# Altium project RF_board.PrjPCB
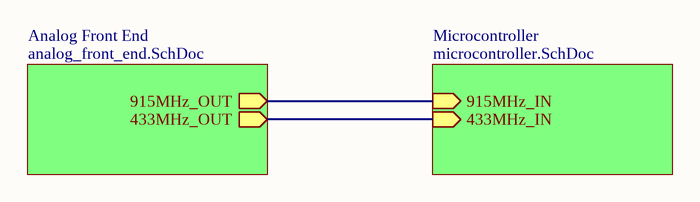
[diagram p0: RF_top.SchDoc]
3 sheets, 87 parts. Net scope: hierarchical (ports join the sheet entries above them; power ports are global).
Board file: RF_board.PcbDoc
Sheets:
  RF_top.SchDoc
    Analog Front End = analog_front_end.SchDoc
    Microcontroller = microcontroller.SchDoc

## Sheet RF_top.SchDoc
size A

### Sub-sheets
Analog Front End = analog_front_end.SchDoc: 915MHz_OUT (out), 433MHz_OUT (out)
Microcontroller = microcontroller.SchDoc: 915MHz_IN (in), 433MHz_IN (in)

### Nets
NetC16_2: sheet Analog Front End/915MHz_OUT, sheet Microcontroller/915MHz_IN
NetC26_2: sheet Analog Front End/433MHz_OUT, sheet Microcontroller/433MHz_IN

## Sheet analog_front_end.SchDoc
size B
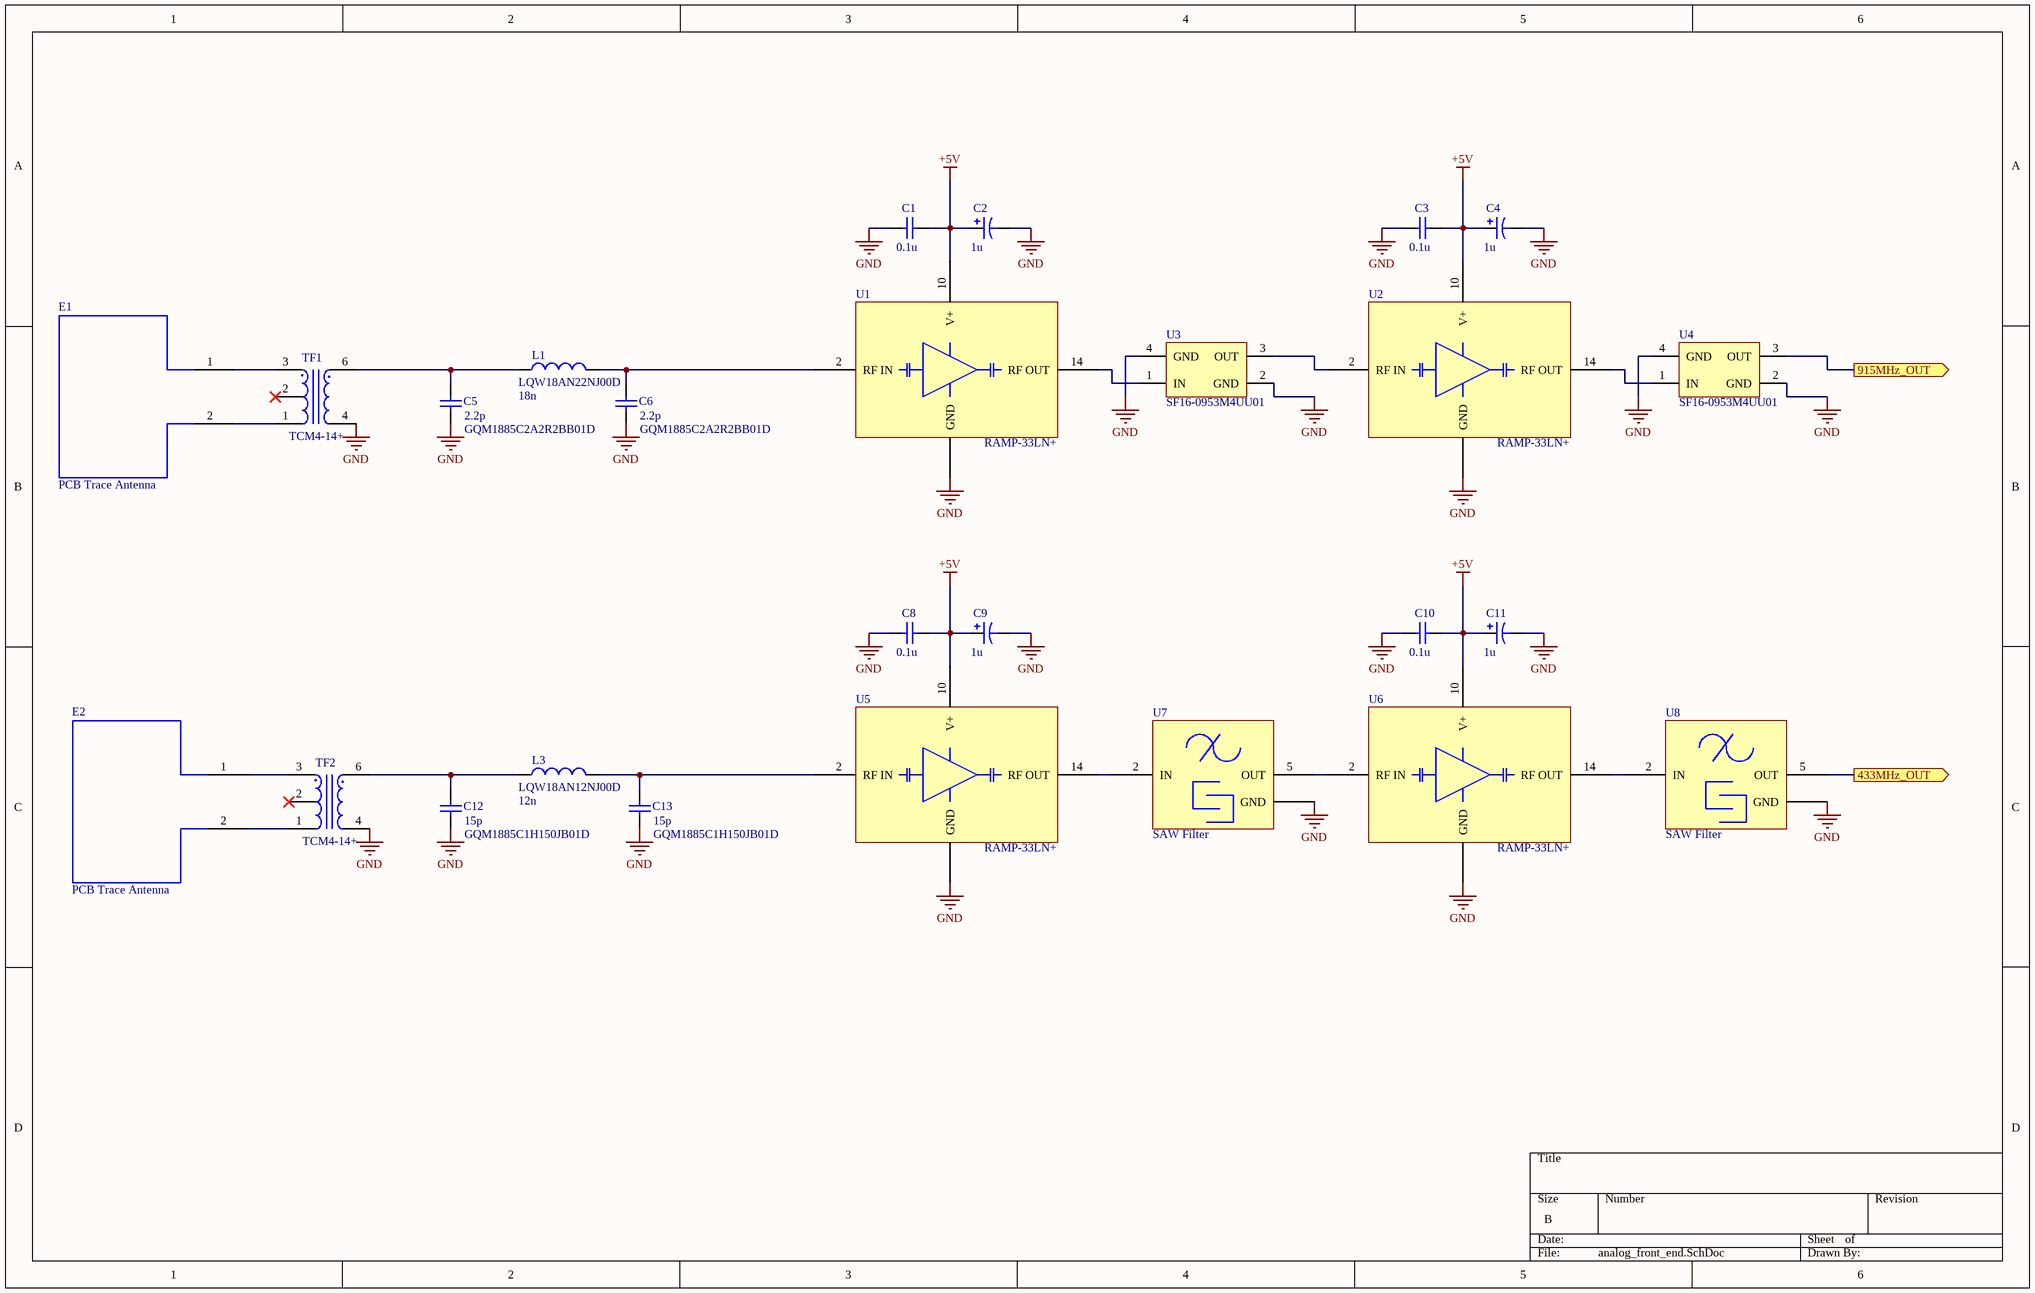
[diagram p1: analog_front_end.SchDoc]

### Parts
C1  value 0.1u  [CAPC1608M]  (hidden comment: Cap Semi)
C2  value 1u  [B]  (hidden comment: Cap Pol3)
C3  value 0.1u  [CAPC1608M]  (hidden comment: Cap Semi)
C4  value 1u  [B]  (hidden comment: Cap Pol3)
C5  GQM1885C2A2R2BB01D  value 2.2p  [CAPC1608M]
C6  GQM1885C2A2R2BB01D  value 2.2p  [CAPC1608M]
C8  value 0.1u  [CAPC1608M]  (hidden comment: Cap Semi)
C9  value 1u  [B]  (hidden comment: Cap Pol3)
C10  value 0.1u  [CAPC1608M]  (hidden comment: Cap Semi)
C11  value 1u  [B]  (hidden comment: Cap Pol3)
C12  GQM1885C1H150JB01D  value 15p  [CAPC1608M]
C13  GQM1885C1H150JB01D  value 15p  [CAPC1608M]
E1  PCB Trace Antenna  [PCB Trace Antenna]
E2  PCB Trace Antenna  [PCB Trace Antenna]
L1  LQW18AN22NJ00D  value 18n  [INDC1608M]
L3  LQW18AN12NJ00D  value 12n  [INDC1608M]
TF1  TCM4-14+  [TCM4-14+]
TF2  TCM4-14+  [TCM4-14+]
U1  RAMP-33LN+  [RAMP-33LN+]
U2  RAMP-33LN+  [RAMP-33LN+]
U3  SF16-0953M4UU01  [SF16-0953M4UU01]
U4  SF16-0953M4UU01  [SF16-0953M4UU01]
U5  RAMP-33LN+  [RAMP-33LN+]
U6  RAMP-33LN+  [RAMP-33LN+]
U7  SAW Filter  [Epcos SAW Filter]
U8  SAW Filter  [Epcos SAW Filter]

### Ports
433MHz_OUT (out), 915MHz_OUT (out)

### Nets
+5V: C1.1 C2.1 C3.1 C4.1 C8.1 C9.1 C10.1 C11.1 U1.10(V+) U2.10(V+) U5.10(V+) U6.10(V+)
GND: C1.2 C2.2 C3.2 C4.2 C5.1 C6.1 C8.2 C9.2 C10.2 C11.2 C12.1 C13.1 TF1.4 TF2.4 U1.1(GND) U1.3(GND) U1.4(GND) U1.5(GND) U1.6(GND) U1.7(GND) U1.8(GND) U1.9(GND) U1.11(GND) U1.12(GND) U1.13(GND) U1.15(GND) U1.16(GND) U2.1(GND) U2.3(GND) U2.4(GND) U2.5(GND) U2.6(GND) U2.7(GND) U2.8(GND) U2.9(GND) U2.11(GND) U2.12(GND) U2.13(GND) U2.15(GND) U2.16(GND) U3.2(GND) U3.4(GND) U4.2(GND) U4.4(GND) U5.1(GND) U5.3(GND) U5.4(GND) U5.5(GND) U5.6(GND) U5.7(GND) U5.8(GND) U5.9(GND) U5.11(GND) U5.12(GND) U5.13(GND) U5.15(GND) U5.16(GND) U6.1(GND) U6.3(GND) U6.4(GND) U6.5(GND) U6.6(GND) U6.7(GND) U6.8(GND) U6.9(GND) U6.11(GND) U6.12(GND) U6.13(GND) U6.15(GND) U6.16(GND) U7.1(GND) U7.3(GND) U7.4(GND) U7.6(GND) U8.1(GND) U8.3(GND) U8.4(GND) U8.6(GND)
NetC5_2: C5.2 L1.1 TF1.6
NetC6_2: C6.2 L1.2 U1.2(RF_IN)
NetC12_2: C12.2 L3.1 TF2.6
NetC13_2: C13.2 L3.2 U5.2(RF_IN)
NetC16_2: U4.3(OUT) ; port 915MHz_OUT
NetC26_2: U8.5(OUT) ; port 433MHz_OUT
NetE1_1: E1.1 TF1.3
NetE1_2: E1.2 TF1.1
NetE2_1: E2.1 TF2.3
NetE2_2: E2.2 TF2.1
NetU1_14: U1.14(RF_OUT) U3.1(IN)
NetU2_2: U2.2(RF_IN) U3.3(OUT)
NetU2_14: U2.14(RF_OUT) U4.1(IN)
NetU5_14: U5.14(RF_OUT) U7.2(IN)
NetU6_2: U6.2(RF_IN) U7.5(OUT)
NetU6_14: U6.14(RF_OUT) U8.2(IN)

Not connected (* = marked no-connect by the designer): TF1 2*; TF2 2*

### Library data of the parts
C1 C3 C5 C6 C8 C10 C12 C13 = Cap Semi: Capacitor (Semiconductor SIM Model); Published: 8-Jun-2000; LatestRevisionDate: 29-May-2009; LatestRevisionNote: IPC-7351 Footprint Added.; PackageReference: C1206; Publisher: Altium Limited; PackageDescription: Chip Capacitor
C2 C4 C9 C11 = Cap Pol3: Polarized Capacitor (Surface Mount); Published: 8-Jun-2000; LatestRevisionDate: 29-May-2009; LatestRevisionNote: IPC-7351 Footprint Added.; PackageReference: C0805; Publisher: Altium Limited; PackageDescription: Chip Capacitor
L1 L3 = Inductor: Code_IEC: 1005; Published: 8-Jun-2000; LatestRevisionDate: 29-May-2009; LatestRevisionNote: IPC-7351 Footprint Added.; PackageReference: 0402-A; Publisher: Altium Limited; PackageDescription: Chip Inductor; Code_JEITA: 0402
TF1 TF2 = TCM4-14+: Mini-Circuits Surface Mount RF Transformer; Manufacturer's Part No.: TCM4-14+; Mini-Circuits: TCM4-14+
U1 U2 U5 U6 = RAMP-33LN+: Mini-Circuits - RAMP-33LN+; Manufacturer's Part No.: RAMP-33LN+
U3 U4 = SF16-0953M4UU01: AVX Corp/Kyocera Corp - FILTER SAW 953MHZ RF SMD; Digikey Number: 478-6489-1-ND

## Sheet microcontroller.SchDoc
size B
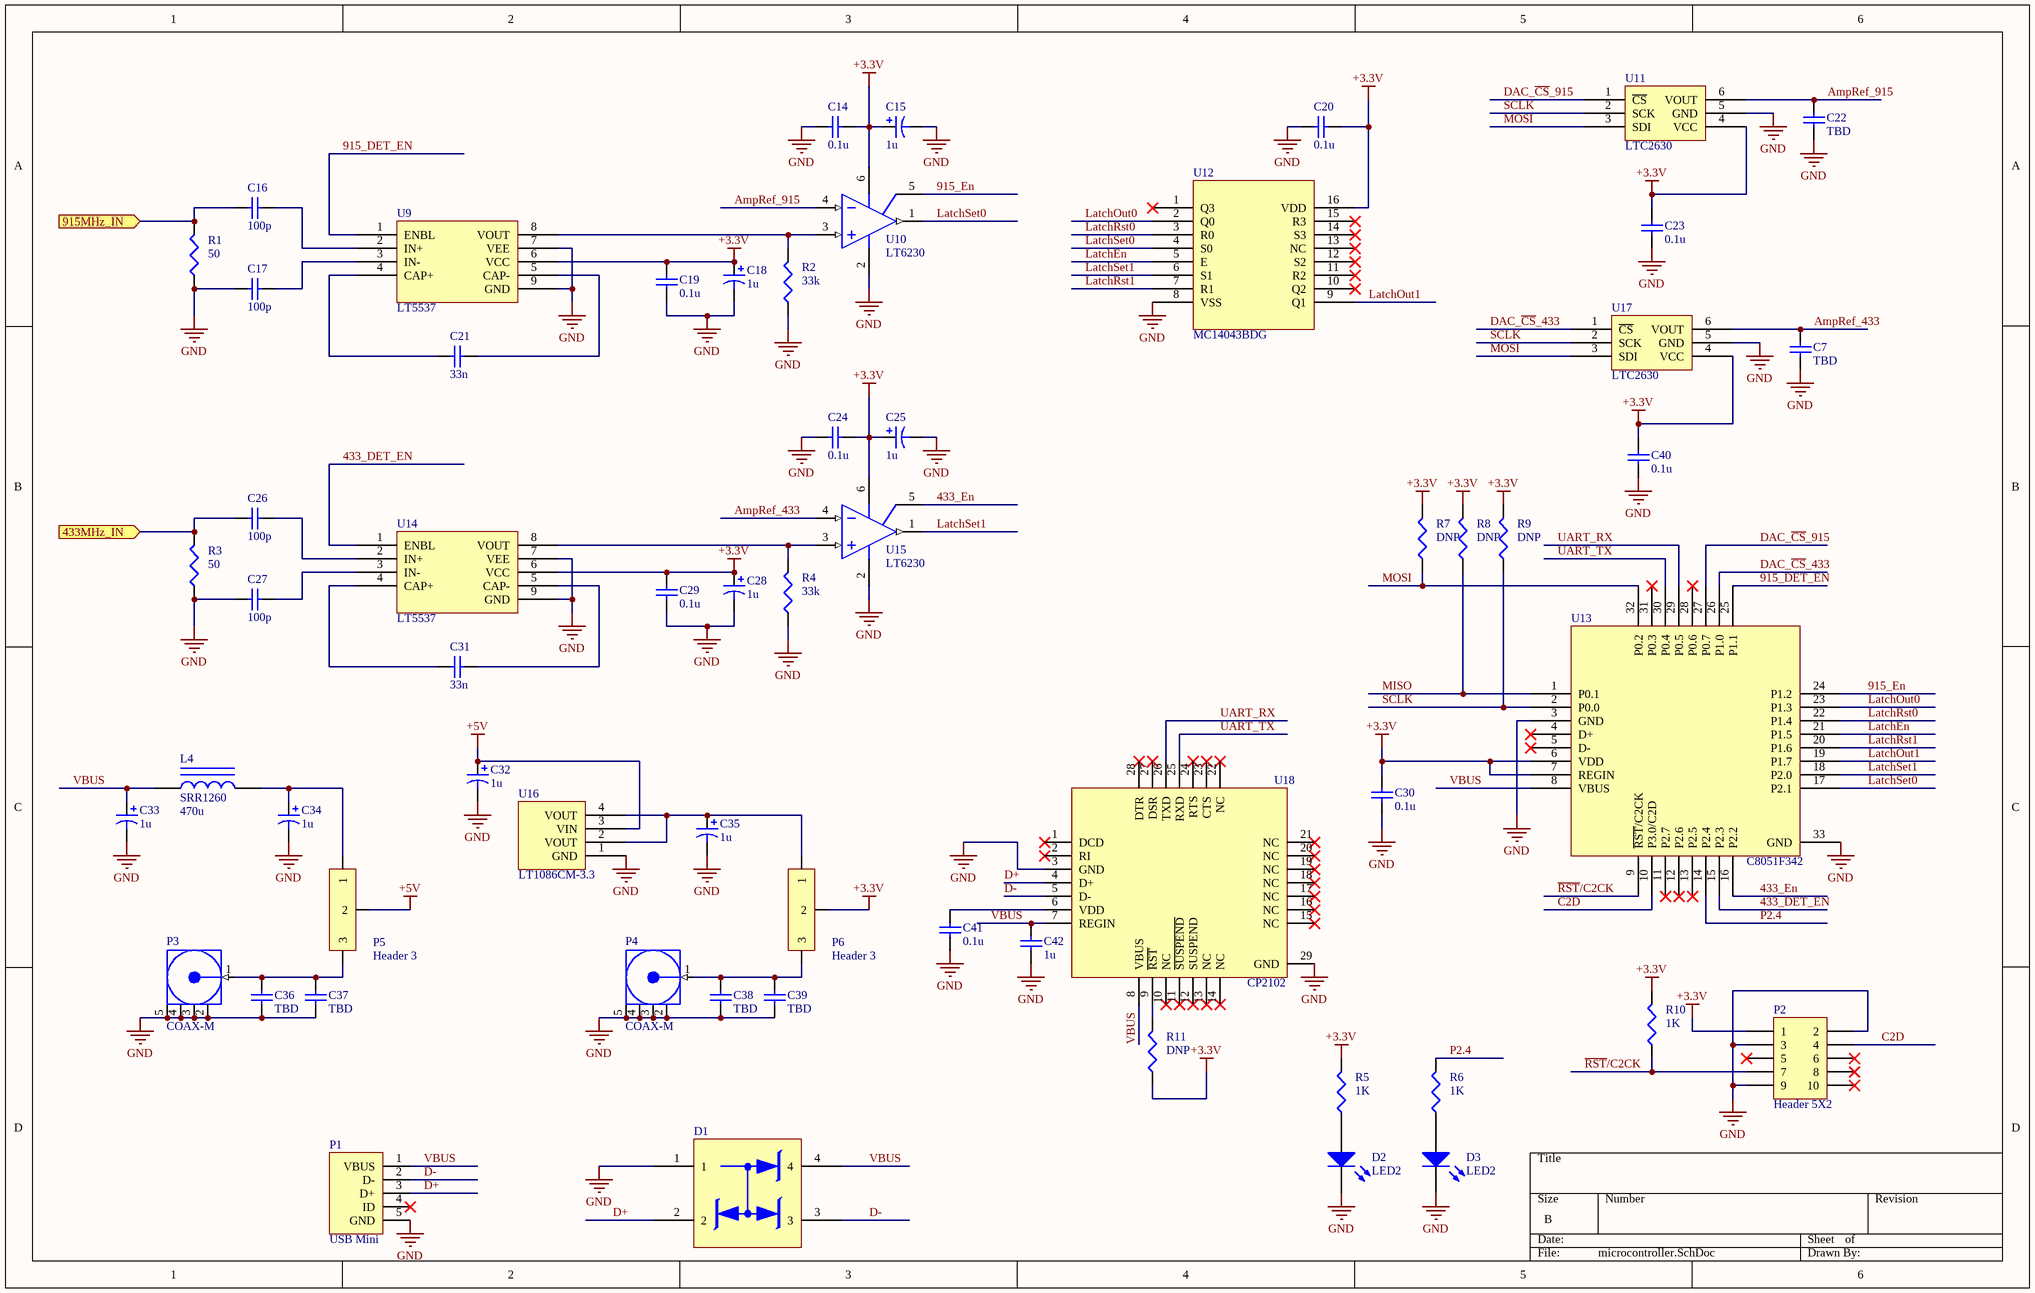
[diagram p2: microcontroller.SchDoc]

### Parts
C7  value TBD  [CAPC1608M]  (hidden comment: Cap Semi)
C14  value 0.1u  [CAPC1608M]  (hidden comment: Cap Semi)
C15  value 1u  [B]  (hidden comment: Cap Pol3)
C16  value 100p  [CAPC1005L]  (hidden comment: Cap Semi)
C17  value 100p  [CAPC1005L]  (hidden comment: Cap Semi)
C18  value 1u  [B]  (hidden comment: Cap Pol3)
C19  value 0.1u  [CAPC1608M]  (hidden comment: Cap Semi)
C20  value 0.1u  [CAPC1608M]  (hidden comment: Cap Semi)
C21  value 33n  [CAPC1005L]  (hidden comment: Cap Semi)
C22  value TBD  [CAPC1608M]  (hidden comment: Cap Semi)
C23  value 0.1u  [CAPC1608M]  (hidden comment: Cap Semi)
C24  value 0.1u  [CAPC1608M]  (hidden comment: Cap Semi)
C25  value 1u  [B]  (hidden comment: Cap Pol3)
C26  value 100p  [CAPC1005L]  (hidden comment: Cap Semi)
C27  value 100p  [CAPC1005L]  (hidden comment: Cap Semi)
C28  value 1u  [B]  (hidden comment: Cap Pol3)
C29  value 0.1u  [CAPC1608M]  (hidden comment: Cap Semi)
C30  value 0.1u  [CAPC1608M]  (hidden comment: Cap Semi)
C31  value 33n  [CAPC1005L]  (hidden comment: Cap Semi)
C32  value 1u  [B]  (hidden comment: Cap Pol3)
C33  value 1u  [B]  (hidden comment: Cap Pol3)
C34  value 1u  [B]  (hidden comment: Cap Pol3)
C35  value 1u  [B]  (hidden comment: Cap Pol3)
C36  value TBD  [CAPC1608M]  (hidden comment: Cap Semi)
C37  value TBD  [CAPC1608M]  (hidden comment: Cap Semi)
C38  value TBD  [CAPC1608M]  (hidden comment: Cap Semi)
C39  value TBD  [CAPC1608M]  (hidden comment: Cap Semi)
C40  value 0.1u  [CAPC1608M]  (hidden comment: Cap Semi)
C41  value 0.1u  [CAPC1608M]  (hidden comment: Cap Semi)
C42  value 1u  [CAPC1608M]  (hidden comment: Cap Semi)
D1  SP0503BAHT  [SOT190P230X110-4M]  (value not drawn)
D2  LED2  [3.2X1.6X1.1]
D3  LED2  [3.2X1.6X1.1]
L4  SRR1260  value 470u  [SRR1260]
P1  USB Mini  [Hirose - ZX62-B-5PA(11)]
P2  Header 5X2  [HDR2X5]
P3  COAX-M  [SMA Connector]
P4  COAX-M  [SMA Connector]
P5  Header 3  [HDR1X3]
P6  Header 3  [HDR1X3]
R1  value 50  [RESC1005L]  (hidden comment: Res3)
R2  value 33k  [RESC1608M]  (hidden comment: Res3)
R3  value 50  [RESC1005L]  (hidden comment: Res3)
R4  value 33k  [RESC1608M]  (hidden comment: Res3)
R5  value 1K  [RESC1608M]  (hidden comment: Res3)
R6  value 1K  [RESC1608M]  (hidden comment: Res3)
R7  value DNP  [RESC1608M]  (hidden comment: Res3)
R8  value DNP  [RESC1608M]  (hidden comment: Res3)
R9  value DNP  [RESC1608M]  (hidden comment: Res3)
R10  value 1K  [RESC1608M]  (hidden comment: Res3)
R11  value DNP  [RESC1608M]  (hidden comment: Res3)
U9  LT5537  [DDB Package]
U10  LT6230  [SOT100P275-6M]
U11  LTC2630  [SOT100P275-6M]
U12  MC14043BDG  [SOIC127P602-16BM]
U13  C8051F342  [QFN50P500X500-32VBM]
U14  LT5537  [DDB Package]
U15  LT6230  [SOT100P275-6M]
U16  LT1086CM-3.3  [TO254P1420-4AM]
U17  LTC2630  [SOT100P275-6M]
U18  CP2102  [QFN50P500X500-28V1L]

### Ports
433MHz_IN (in), 915MHz_IN (in)

### Nets
+3.3V: C14.2 C15.1 C18.1 C19.1 C20.2 C23.2 C24.2 C25.1 C28.1 C29.1 C30.2 C40.2 P2.1 P6.2 R5.2 R7.2 R8.2 R9.2 R10.2 R11.1 U9.6(VCC) U10.6(V+) U11.4(VCC) U12.16(VDD) U13.6(VDD) U13.7(REGIN) U14.6(VCC) U15.6(V+) U17.4(VCC)
+5V: C32.1 P5.2 U16.3(VIN)
GND: C7.1 C14.1 C15.2 C17.2 C18.2 C19.2 C20.1 C22.1 C23.1 C24.1 C25.2 C27.2 C28.2 C29.2 C30.1 C32.2 C33.2 C34.2 C35.2 C36.2 C37.2 C38.2 C39.2 C40.1 C41.1 C42.1 D1.1 D2.2(K) D3.2(K) P1.5(GND) P2.2 P2.3 P2.9 P3.2(GND) P3.3(GND) P3.4(GND) P3.5(GND) P4.2(GND) P4.3(GND) P4.4(GND) P4.5(GND) R1.1 R2.1 R3.1 R4.1 U9.7(VEE) U9.9(GND) U10.2(V-) U11.5(GND) U12.8(VSS) U13.3(GND) U13.33(GND) U14.7(VEE) U14.9(GND) U15.2(V-) U16.1(GND) U17.5(GND) U18.3(GND) U18.29(GND)
433_DET_EN: U13.15(P2.3) U14.1(ENBL)
433_En: U13.16(P2.2) U15.5(~{ENABLE})
915_DET_EN: U9.1(ENBL) U13.25(P1.1)
915_En: U10.5(~{ENABLE}) U13.24(P1.2)
AmpRef_433: C7.2 U15.4(-IN) U17.6(VOUT)
AmpRef_915: C22.2 U10.4(-IN) U11.6(VOUT)
C2D: P2.4 U13.10(P3.0/C2D)
D+: D1.2 P1.3(D+) U18.4(D+)
D-: D1.3 P1.2(D-) U18.5(D-)
DAC_~{CS}_433: U13.26(P1.0) U17.1(~{CS})
DAC_~{CS}_915: U11.1(~{CS}) U13.27(P0.7)
LatchEn: U12.5(E) U13.21(P1.5)
LatchOut0: U12.2(Q0) U13.23(P1.3)
LatchOut1: U12.9(Q1) U13.19(P1.7)
LatchRst0: U12.3(R0) U13.22(P1.4)
LatchRst1: U12.7(R1) U13.20(P1.6)
LatchSet0: U10.1(OUT) U12.4(S0) U13.17(P2.1)
LatchSet1: U12.6(S1) U13.18(P2.0) U15.1(OUT)
MISO: R8.1 U13.1(P0.1)
MOSI: R7.1 U11.3(SDI) U13.32(P0.2) U17.3(SDI)
P2.4: R6.2 U13.14(P2.4)
~{RST}/C2CK: P2.7 R10.1 U13.9(~{RST}/C2CK)
SCLK: R9.1 U11.2(SCK) U13.2(P0.0) U17.2(SCK)
UART_RX: U13.29(P0.5) U18.26(TXD)
UART_TX: U13.30(P0.4) U18.25(RXD)
VBUS: C33.1 C42.2 D1.4 L4.1 P1.1(VBUS) U13.8(VBUS) U18.7(REGIN) U18.8(VBUS)
NetC16_1: C16.1 U9.2(IN+)
NetC16_2: C16.2 R1.2 ; port 915MHz_IN
NetC17_1: C17.1 U9.3(IN-)
NetC21_1: C21.1 U9.5(CAP-)
NetC21_2: C21.2 U9.4(CAP+)
NetC26_1: C26.1 U14.2(IN+)
NetC26_2: C26.2 R3.2 ; port 433MHz_IN
NetC27_1: C27.1 U14.3(IN-)
NetC31_1: C31.1 U14.5(CAP-)
NetC31_2: C31.2 U14.4(CAP+)
NetC34_1: C34.1 L4.2 P5.1
NetC35_1: C35.1 P6.1 U16.2(VOUT) U16.4(VOUT)
NetC36_1: C36.1 C37.1 P3.1(Signal) P5.3
NetC38_1: C38.1 C39.1 P4.1(Signal) P6.3
NetC41_2: C41.2 U18.6(VDD)
NetD2_1: D2.1(A) R5.1
NetD3_1: D3.1(A) R6.1
NetR2_2: R2.2 U9.8(VOUT) U10.3(+IN)
NetR4_2: R4.2 U14.8(VOUT) U15.3(+IN)
NetR11_2: R11.2 U18.9(~{RST})

Not connected (* = marked no-connect by the designer): P1 4(ID)*; P2 5* 6* 8* 10*; U12 1(Q3)* 10(Q2)* 11(R2)* 12(S2)* 13(NC)* 14(S3)* 15(R3)*; U13 4(D+)* 5(D-)* 11(P2.7)* 12(P2.6)* 13(P2.5)* 28(P0.6)* 31(P0.3)*; U18 1(DCD)* 2(RI)* 10(NC)* 11(~{SUSPEND})* 12(SUSPEND)* 13(NC)* 14(NC)* 15(NC)* 16(NC)* 17(NC)* 18(NC)* 19(NC)* 20(NC)* 21(NC)* 22(NC)* 23(CTS)* 24(RTS)* 27(DSR)* 28(DTR)*

### Library data of the parts
C7 C14 C16 C17 C19-C24 C26 C27 C29-C31 C36-C42 = Cap Semi: Capacitor (Semiconductor SIM Model); Published: 8-Jun-2000; LatestRevisionDate: 29-May-2009; LatestRevisionNote: IPC-7351 Footprint Added.; PackageReference: C1206; Publisher: Altium Limited; PackageDescription: Chip Capacitor
C15 C18 C25 C28 C32-C35 = Cap Pol3: Polarized Capacitor (Surface Mount); Published: 8-Jun-2000; LatestRevisionDate: 29-May-2009; LatestRevisionNote: IPC-7351 Footprint Added.; PackageReference: C0805; Publisher: Altium Limited; PackageDescription: Chip Capacitor
D1 = SP0503BAHT: Littelfuse Inc - TVS AVAL DIODE ARRAY 3 CH SOT143; Manufacturer's Part No.: SP0503BAHTG; Digikey: F2715CT-ND
D2 D3 = LED2: Typical RED, GREEN, YELLOW, AMBER GaAs LED; Published: 8-Jun-2000; LatestRevisionDate: 17-Jul-2002; LatestRevisionNote: Re-released for DXP Platform.; PackageVersion: Feb-2002; PackageReference: 3.2X1.6X1.1; Publisher: Altium Limited; PackageDescription: SM LED; 2 Flat Leads
L4 = Inductor Iron: Magnetic-Core Inductor; Manufacturer's Part No.: SRR1260-471K; Published: 24-Mar-1999; LatestRevisionDate: 17-Jul-2002; LatestRevisionNote: Re-released for DXP Platform.; PackageReference: AXIAL-0.9; Publisher: Altium Limited; PackageDescription: Axial Device, Thru-Hole; 2 Leads; 0.9 in Pin Spacing; Digikey: SRR1260-471KCT-ND
P1 = USB Mini: Hirose Electric Co Ltd - CONN RCPT MICRO USB B SMD R/A; Manufacturer's Part No.: ZX62-B-5PA(11); Digikey: H11634CT-ND
P2 = Header 5X2: Header, 5-Pin, Dual row; LatestRevisionDate: 17-Jul-2002; LatestRevisionNote: Re-released for DXP Platform.; Publisher: Altium Limited
P3 P4 = COAX-M: RF Coaxial PCB Connector, MMCX; Thru-Hole, Vertical Mount Plug,  50 Ohm Impedance; PackageDocument: Rev. A, 16-Jun-1997; PCB_Layout: Complies with manufacturer's recommendation.; DrillSize: Corresponds to nominal value.; Published: 15-Jul-2004; LatestRevisionDate: 15-Jul-2004; LatestRevisionNote: Component Replaced.; DatasheetDocument: 30-May-2003; PackageReference: 908-21103; Publisher: Altium Limited; ComponentLink1Description: Manufacturer Link; ComponentLink1URL: http://www.amphenolrf.com/
P5 P6 = Header 3: 3-pin, IDC Jumper; LatestRevisionDate: 17-Jul-2002; LatestRevisionNote: Re-released for DXP Platform.; Publisher: Altium Limited
R1-R11 = Res3: Resistor; Published: 8-Jun-2000; LatestRevisionDate: 29-May-2009; LatestRevisionNote: IPC-7351 Footprint Added.; PackageReference: J1-0603; Publisher: Altium Limited; PackageDescription: Chip Resistor
U9 U14 = LT5537: Linear Technology - IC RF/IF LOG DETECTOR 8-DFN; Manufacturer's Part No.: LT5537EDDB#TRMPBF; Digikey: LT5537EDDB#TRMPBFCT-ND
U10 U15 = LT6230: Linear Technology - IC OP AMP 3.4MA 215MHZ SOT23-6; Manufacturer's Part No.: LT6230CS6#TRMPBF; Digikey: LT6230CS6#TRMPBFCT-ND
U11 U17 = LTC2630: Linear Technology - IC DAC 12BIT R-R SC70-6; Manufacturer's Part No.: LTC2630ISC6-LZ12#TRMPBF; Digikey: LTC2630ISC6-LZ12#TRMPBFCT-ND
U12 = MC14043BDG: ON Semiconductor - IC LATCH R-S QUAD NOR 16SOIC; Manufacturer's Part No.: MC14043BDG; Digikey: MC14043BDGOS-ND
U13 = C8051F342: Silicon Laboratories Inc - IC 8051 MCU 64K FLASH MEM 32-QFN; Manufacturer's Part No.: C8051F342-GM; Digikey: 336-1345-5-ND
U16 = LT1086CM-3.3: Linear Technology - IC REG LDO 3.3V 3DD; Manufacturer's Part No.: LT1086CM-3.3#PBF; Digikey: LT1086CM-3.3#PBF-ND
U18 = CP2102: IC USB-TO-UART BRIDGE 28VQFN

## Nets that join several sheets
+5V: analog_front_end (12 pins), microcontroller (C32.1 P5.2 U16.3)
GND: analog_front_end (78 pins), microcontroller (59 pins)
NetC16_2: analog_front_end (U4.3), microcontroller (C16.2 R1.2)
NetC26_2: analog_front_end (U8.5), microcontroller (C26.2 R3.2)